# Altium schematic sheet TOP.SchDoc
size A3; DocumentNumber: 1; SheetNumber: 1; SheetTotal: 4
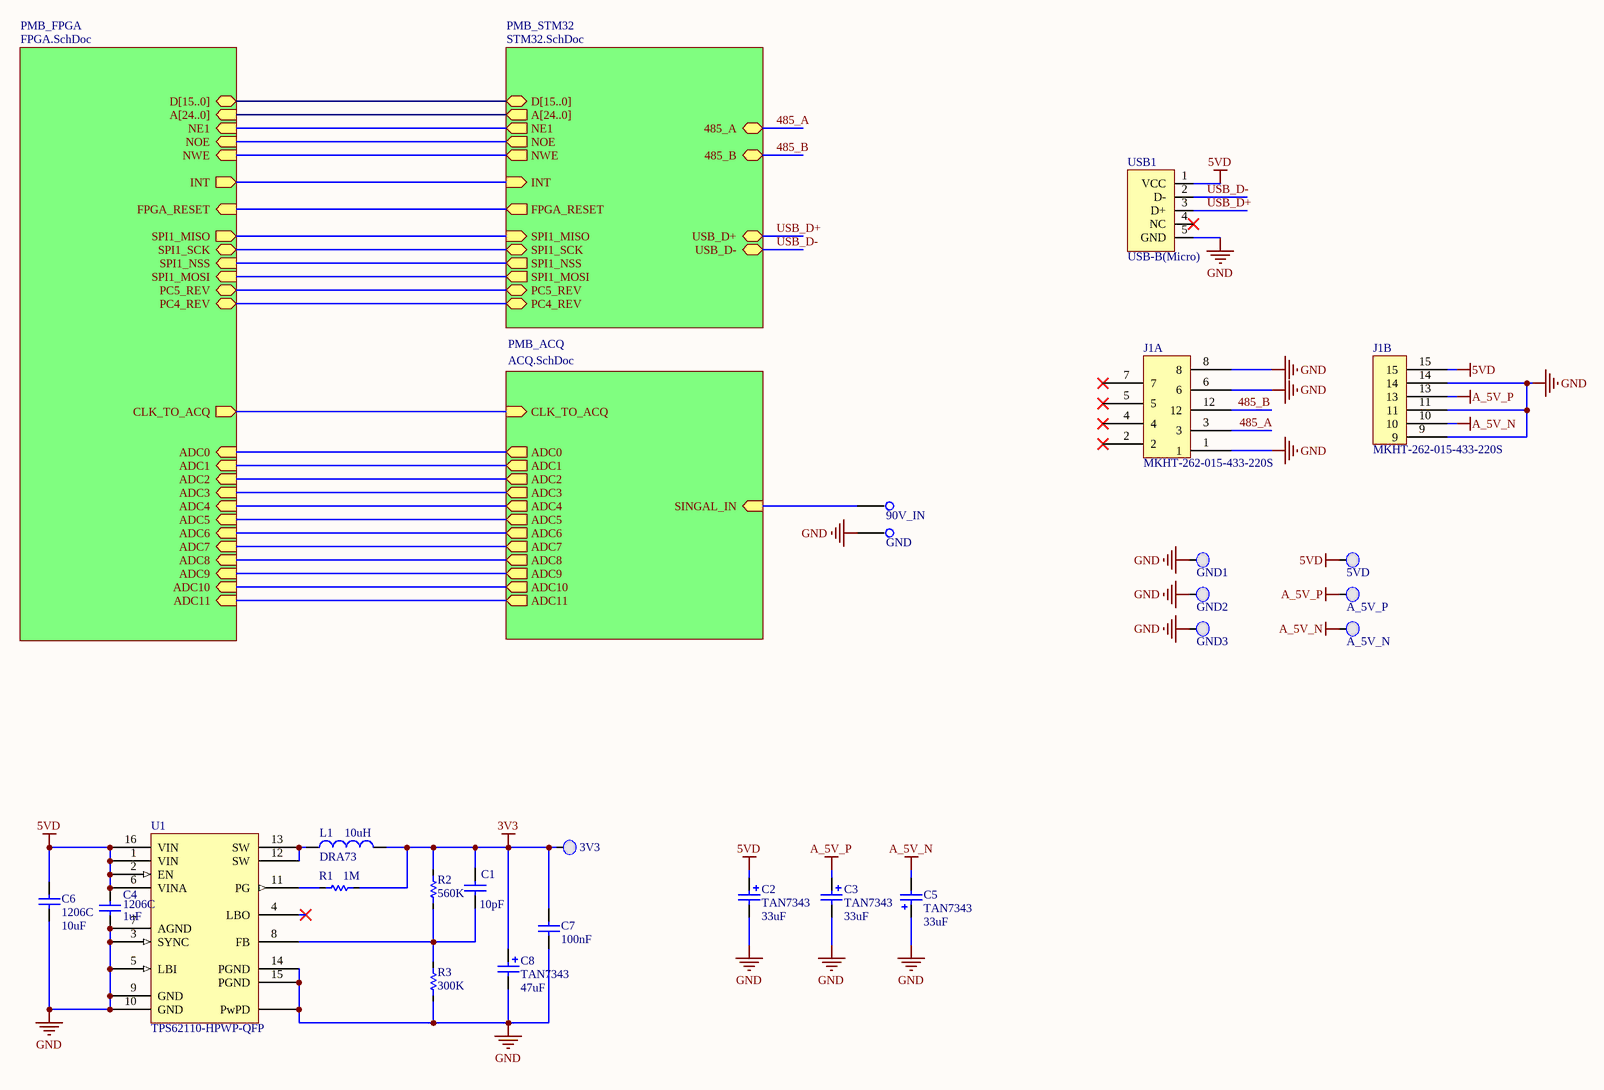
[diagram p0: TOP.SchDoc]

## Parts
3V3  TP  [TPA]  (value not drawn)
5VD  TP  [TPA]  (value not drawn)
90V_IN  InOut  [TERMPOWER]  (value not drawn)
A_5V_N  TP  [TPA]  (value not drawn)
A_5V_P  TP  [TPA]  (value not drawn)
C1  10pF  [0805C]
C2  TAN7343  value 33uF  [7343C]
C3  TAN7343  value 33uF  [7343C]
C4  1uF  [1206C]
C5  TAN7343  value 33uF  [7343C]
C6  10uF  [1206C]
C7  100nF  [0805C]
C8  TAN7343  value 47uF  [7343C]
GND  InOut  [TERMPOWER]  (value not drawn)
GND1  TP  [TPA]  (value not drawn)
GND2  TP  [TPA]  (value not drawn)
GND3  TP  [TPA]  (value not drawn)
J1  MKHT-262-015-433-220S  [MKHT-262-015-433-220S]  (parts A,B of 2)
L1  DRA73  value 10uH  [INDP7676X35N]
R1  1M  [0805R]
R2  560K  [0805R]
R3  300K  [0805R]
U1  TPS62110-HPWP-QFP  [PWP16]
USB1  USB-B(Micro)  [MICRO-USB-SMD_5P-P0.65-H-F_C10418]

## Sub-sheets
PMB_ACQ = ACQ.SchDoc: ADC11 (out), ADC10 (out), ADC9 (out), ADC8 (out), ADC7 (out), ADC6 (out), ADC5 (out), ADC1 (out), ADC4 (out), ADC0 (out), ADC3 (out), CLK_TO_ACQ (in), ADC2 (out), SINGAL_IN (in)
PMB_FPGA = FPGA.SchDoc: D[15..0] (bidir), A[24..0] (in), FPGA_RESET (in), NE1 (in), NOE (in), NWE (in), ADC11 (in), ADC10 (in), ADC9 (in), ADC8 (in), ADC7 (in), ADC6 (in), ADC5 (in), ADC1 (in), ADC4 (in), ADC0 (in), ADC3 (in), ADC2 (in), CLK_TO_ACQ (out), INT (out), SPI1_MISO (out), SPI1_SCK (bidir), SPI1_NSS (in), SPI1_MOSI (in), PC5_REV (bidir), PC4_REV (bidir)
PMB_STM32 = STM32.SchDoc: D[15..0] (bidir), A[24..0] (out), 485_B (bidir), 485_A (bidir), NE1 (out), NOE (out), NWE (out), INT (in), FPGA_RESET (out), SPI1_MISO (in), SPI1_SCK (bidir), SPI1_NSS (out), SPI1_MOSI (out), PC5_REV (bidir), PC4_REV (bidir), USB_D+ (bidir), USB_D- (bidir)

## Nets
3V3: 3V3.1(TP) C1.2 C7.2 C8.1 L1.2 R1.2 R2.2
5VD: 5VD.1(TP) C2.1 C4.1 C6.1 J1.15 U1.1(VIN) U1.2(EN) U1.6(VINA) U1.16(VIN) USB1.1(VCC)
A_5V_N: A_5V_N.1(TP) C5.2 J1.10
A_5V_P: A_5V_P.1(TP) C3.1 J1.13
GND: C2.2 C3.2 C4.2 C5.1 C6.2 C7.1 C8.2 GND.1(NC) GND1.1(TP) GND2.1(TP) GND3.1(TP) J1.1 J1.6 J1.8 J1.9 J1.11 J1.14 R3.1 U1.3(SYNC) U1.5(LBI) U1.7(AGND) U1.9(GND) U1.10(GND) U1.14(PGND) U1.15(PGND) U1.PwPD USB1.5(GND)
485_A: J1.3 ; sheet PMB_STM32/485_A
485_B: J1.12 ; sheet PMB_STM32/485_B
USB_D+: USB1.3(D+) ; sheet PMB_STM32/USB_D+
USB_D-: USB1.2(D-) ; sheet PMB_STM32/USB_D-
Net90V_IN_1: 90V_IN.1(NC) ; sheet PMB_ACQ/SINGAL_IN
NetC1_1: C1.1 R2.1 R3.2 U1.8(FB)
NetL1_1: L1.1 U1.12(SW) U1.13(SW)
NetR1_1: R1.1 U1.11(PG)
(unnamed): sheet PMB_STM32/NE1, sheet PMB_FPGA/NE1
(unnamed): sheet PMB_STM32/NOE, sheet PMB_FPGA/NOE
(unnamed): sheet PMB_STM32/NWE, sheet PMB_FPGA/NWE
(unnamed): sheet PMB_STM32/INT, sheet PMB_FPGA/INT
(unnamed): sheet PMB_STM32/FPGA_RESET, sheet PMB_FPGA/FPGA_RESET
(unnamed): sheet PMB_STM32/SPI1_MISO, sheet PMB_FPGA/SPI1_MISO
(unnamed): sheet PMB_STM32/SPI1_SCK, sheet PMB_FPGA/SPI1_SCK
(unnamed): sheet PMB_STM32/SPI1_NSS, sheet PMB_FPGA/SPI1_NSS
(unnamed): sheet PMB_STM32/SPI1_MOSI, sheet PMB_FPGA/SPI1_MOSI
(unnamed): sheet PMB_STM32/PC5_REV, sheet PMB_FPGA/PC5_REV
(unnamed): sheet PMB_STM32/PC4_REV, sheet PMB_FPGA/PC4_REV
(unnamed): sheet PMB_FPGA/ADC11, sheet PMB_ACQ/ADC11
(unnamed): sheet PMB_FPGA/ADC10, sheet PMB_ACQ/ADC10
(unnamed): sheet PMB_FPGA/ADC9, sheet PMB_ACQ/ADC9
(unnamed): sheet PMB_FPGA/ADC8, sheet PMB_ACQ/ADC8
(unnamed): sheet PMB_FPGA/ADC7, sheet PMB_ACQ/ADC7
(unnamed): sheet PMB_FPGA/ADC6, sheet PMB_ACQ/ADC6
(unnamed): sheet PMB_FPGA/ADC5, sheet PMB_ACQ/ADC5
(unnamed): sheet PMB_FPGA/ADC1, sheet PMB_ACQ/ADC1
(unnamed): sheet PMB_FPGA/ADC4, sheet PMB_ACQ/ADC4
(unnamed): sheet PMB_FPGA/ADC0, sheet PMB_ACQ/ADC0
(unnamed): sheet PMB_FPGA/ADC3, sheet PMB_ACQ/ADC3
(unnamed): sheet PMB_FPGA/ADC2, sheet PMB_ACQ/ADC2
(unnamed): sheet PMB_FPGA/CLK_TO_ACQ, sheet PMB_ACQ/CLK_TO_ACQ

Not connected (* = marked no-connect by the designer): J1 2* 4* 5* 7*; U1 4(LBO)*; USB1 4(NC)*

## Buses and harness runs
bus sheet PMB_FPGA/A[24..0] = sheet PMB_STM32/A[24..0]
bus sheet PMB_FPGA/D[15..0] = sheet PMB_STM32/D[15..0]

## Library data of the parts
C1 C4 C6 C7 = Cap: Capacitor; Published: 8-Jun-2000; LatestRevisionDate: 17-Jul-2002; LatestRevisionNote: Re-released for DXP Platform.; Publisher: Altium Limited; PackageDescription: Radial Cap, Thru-Hole; 2 Leads; 0.3 in Pin Spacing
  C1: PackageReference: RAD-0.3; Value: 10pF
  C4: PackageReference: 1206C; Value: 1uF
  C6: PackageReference: 1206C; Value: 10uF
  C7: PackageReference: RAD-0.3; Value: 100nF
C2 C3 C5 C8 = Cap Pol: Polarized Capacitor (Radial)
L1 = Inductor
R1-R3 = Res1: Resistor; Published: 8-Jun-2000; LatestRevisionDate: 17-Jul-2002; LatestRevisionNote: Re-released for DXP Platform.; PackageReference: AXIAL-0.3; Publisher: Altium Limited; PackageDescription: Axial Device, Thru-Hole; 2 Leads; 0.3 in Pin Spacing
  R1: Value: 1M
  R2: Value: 560K
  R3: Value: 300K
U1 = TPS62110-HPWP: Part Number: Y20033002; 安装形式: SMT; 产品外形尺寸<高>: 1.2mm; 产品外形尺寸<长>: 6.6mm; 产品外形尺寸<宽>: 5.1mm; 引脚数目: 16; 湿敏等级（回流焊峰值）: MSL2(260C); 描述: TI;TPS62110-HPWP;175℃;HTSSOP 16PINS;MSL2(260C); id: wt.part.WTPartMaster:8901760; folder: /Default/电源及电源管理/TPS62110HPWP; 主要参数: 17-V, 1.5-A, SYNCHRONOUS STEP-DOWN CONVERTER; state: APPROVED; parent: 13; Library Path 2: 0; Library Ref: TPS62110-HPWP; Footprint Path: 0; HelpURL: \\10.185.226.160\altium_center_db\DATASHEET\TI TPS62110-HT.pdf; Footprint Ref: 0; Library Path: TPS62110-HT.SchLib; 制造商型号: TPS62110-HPWP; pname: TPS62110-HPWP; Library Ref 2: 0; Footprint Path 2: 0; Footprint Ref 2: 0; Footprint Path 3: 0; Footprint Ref 3: 0
USB1 = USB-micro